# Altium project UJA1169_Test.PrjPcb
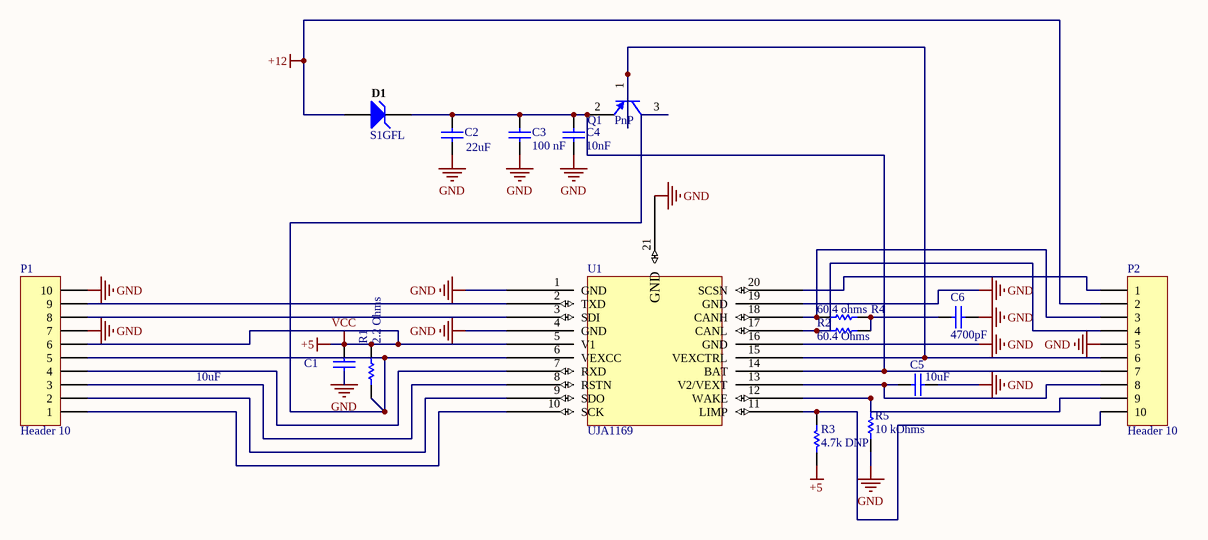
[diagram p0: UJA1169.SchDoc]
1 sheet, 16 parts. Net scope: global (net labels, ports and power ports of the same name join across sheets).
Board file: PCB.PcbDoc

## Sheet UJA1169.SchDoc
size A4; Organization: Altium Limited; Address1: L3, 12a Rodborough Rd; Address2: Frenchs Forest; Address3: NSW; Address4: Australia 2086

### Parts
C1  10uF  [CAPC1206(3216)130_L]
C2  22uF  [CAPC1210(3225)220_M]
C3  100 nF  [CAPC1005X55X10LL05]
C4  10nF  [CAPC1005X55X25NL05T05]
C5  10uF  [CAPC1206(3216)130_L]
C6  4700pF  [CAPC1005X55X25NL05T05]
D1  S1GFL  [VISH-SOD-123-2_V]
P1  Header 10  [HDR1X10]
P2  Header 10  [HDR1X10]
Q1  PnP  [ONSC-SOT-23-3-318-08_V]
R1  2.2 Ohms  [RESC1005X40X25LL10T10]
R2  60.4 Ohms  [RESC1005X40X25LL05T05]
R3  4.7k DNP  [RESC1005X40X25LL05T05]
R4  60.4 ohms  [RESC1005X40X25LL05T05]
R5  10 kOhms  [RESC1005X40X20LL05T10]
U1  UJA1169  [UJA1169_IPCcompliant]

### Nets
+5: C1.2 P1.6 R1.2 R3.2 U1.5(V1)  [also labelled VCC]
+12: D1.1(A) P2.2
GND: C1.1 C2.1 C3.2 C4.2 C5.2 C6.2 P1.7 P1.10 P2.5 R5.2 U1.1(GND) U1.4(GND) U1.16(GND) U1.19(GND) U1.21(GND)
NetC2_2: C2.2 C3.1 C4.1 D1.2(K) P2.7 Q1.2(E) U1.14(BAT)
NetC5_1: C5.1 P2.8 U1.13(V2/VEXT)
NetC6_1: C6.1 R2.2 R4.2
NetP1_1: P1.1 U1.10(SCK)
NetP1_2: P1.2 U1.9(SDO)
NetP1_3: P1.3 U1.8(RSTN)
NetP1_4: P1.4 U1.7(RXD)
NetP1_5: P1.5 Q1.3(C) R1.1 U1.6(VEXCC)
NetP1_8: P1.8 U1.3(SDI)
NetP1_9: P1.9 U1.2(TXD)
NetP2_1: P2.1 U1.20(SCSN)
NetP2_3: P2.3 R4.1 U1.18(CANH)
NetP2_4: P2.4 R2.1 U1.17(CANL)
NetP2_6: P2.6 Q1.1(B) U1.15(VEXCTRL)
NetP2_9: P2.9 R5.1 U1.12(WAKE)
NetP2_10: P2.10 R3.1 U1.11(LIMP)

### Notes on the sheet
- Title
- Size:
- Date:
- A4
- Number:
- Time:
- Revision:
- Sheet
- of
- File:

### Library data of the parts
C1 = CMP-1037-04970-1: C1206X106K8RACAUTO & JMK316BJ106KLHT - Thickness 10V -20% to +80% 1206 SMD; Case-Metric: 3216; Case-EIA: 1206; Value: 10uF; Rated Voltage: 10 V; Technology: SMT; Max Thickness: 1.3 mm; Tolerance: -20% to +80%
C2 = CMP-1038-02286-1: GCJ32ER71C226KE01L - CAP 22uF 25V -20% to +80% 1210 (3225 Metric) Thickness 2.2mm SMD; Case-Metric: 3225; Case-EIA: 1210; Rated Voltage: 25 V; Technology: SMT; Max Thickness: 2.2 mm; Value: 22uF; Tolerance: -20% to +80%
C3 = CMP-2000-05991-1: AC0402KRX7R6BB104 - Multilayer Ceramic Capacitors MLCC - SMD/SMT 100 nF 10% 10V AEC-Q200; Manufacturer: TDK; PCN Part Number: MLCCPartNumberChange30/Nov/2012; Voltage - Rated: 50V; Tolerance: ±5%; Kits: 445-9021-KIT-ND-KITMLCC100PF-10UF04026.3-50V445-9013-KIT-ND-KITMLCC0.50PF-91PF040250V; Temperature Coefficient: C0G,NP0; Capacitance: 100pF; Other Names: 445-1247-1; Product Training Modules: CSeriesGeneralApplicationsSEAT,CCV,andTVCLDesignToolsGuidetoReplacinganElectrolyticCapacitorwithanMLCC; Online Catalog: CSeries,GeneralPurpose; Datasheet URL: https://product.tdk.com/info/en/catalog/datasheets/mlcc_commercial_general_en.pdf; Lead Style: -; Mounting Technology: SurfaceMount; Features: -; Manufacturer URL: http://www.tdk.com/; Datasheet Version: 08/2016; Applications: GeneralPurpose; Lead Spacing: -; Operating Temperature: -55°C~125°C; Series: C; Standard Package: 1; Package / Case: 0402(1005Metric); Packaging: CutTape(CT); Category: Capacitors; RoHS Information: RoHSCertificate-MLCC; Mounting Type: SurfaceMount,MLCC; Height - Seated (Max): -; Family: CeramicCapacitors; Package Reference: 1005; Package Description: 2-Pin Surface Mount Device, Body 1 x 0.5 mm; Ratings: -
C4 = CMP-2008-00001-1: AC0402KRX7R8BB103 - 10000PF 25V X7R 0402; Manufacturer: Kemet; Part Number: CBR04C100J5GAC
C5 = CMP-1037-04970-1: C1206X106K8RACAUTO - Thickness 10V -20% to +80% 1206 SMD; Case-Metric: 3216; Case-EIA: 1206; Value: 10uF; Rated Voltage: 10 V; Technology: SMT; Max Thickness: 1.3 mm; Tolerance: -20% to +80%
C6 = CMP-2008-00001-1: 0402YC472K4T4A; Manufacturer: Kemet; Part Number: CBR04C100J5GAC
D1 = CMP-0931-00020-1: S1GFL - Diode; Manufacturer: Vishay Semiconductor; PartNumber: MMSZ5232B-E3-08; Power Dissipation (mW): 500; Test Current (IZT1) (mA): 20; Zener Voltage (NOM.) (V): 5.6; Zener Impedance (IZT1) (Max.) (Ohm): 11; Tolerance: +/- 5%; Packing: Tape and Reel; Int. Construction: Single; ComponentLink2URL: http://www.vishay.com/docs/85774/mmsz5225.pdf; PackageVersion: Rev. 1.9; Operating Temperature: -55 to 150 degC; ComponentLink1Description: Manufacturer URL; ComponentLink3Description: Package Specification; DatasheetVersion: Rev. 1.9; PackageReference: SOD-123-2; ComponentLink3URL: http://www.vishay.com/docs/85774/mmsz5225.pdf; PackageDescription: 2-Pin SMD, Body 2.7 x 1.55 mm, Height 1.35 mm; ComponentLink1URL: http://www.vishay.com/; RoHS: TRUE; ComponentLink2Description: Datasheet; Mounting Technology: Surface Mount
P1 P2 = Header 10: Header, 10-Pin; LatestRevisionDate: 17-Jul-2002; LatestRevisionNote: Re-released for DXP Platform.; Publisher: Altium Limited
Q1 = CMP-1048-00680-1: NSV1C200LT1G - 100 V, 3 A, Low VCE(sat), PNP Transistor, 3-Pin SOT-23, Pb-Free, Tape and Reel; Manufacturer: On Semiconductor; Note1: 0; IC Continuous (A): -2; Packing: Tape and Reel; ComponentLink3Description: Package Specification; ComponentLink2URL: http://www.onsemi.cn/pub_link/Collateral/NSS1C200L-D.PDF; Mounting Technology: Surface Mount; PackageDescription: 3-Pin Small Outline Transistor, Body 2.92 x 1.3 mm, Pitch 0.95 mm; PackageVersion: Rev. AP, 11/2009; ComponentLink3URL: http://www.onsemi.cn/pub_link/Collateral/318-08.PDF; PackageReference: SOT-23-3-318-08; DatasheetVersion: Rev. 2; RoHS: TRUE; ComponentLink1URL: http://www.onsemi.com/; Polarity: PNP; ComponentLink1Description: Manufacturer URL; PartNumber: NSV1C200LT1G; ComponentLink2Description: Datasheet
R1 = CMP-2002-04163-1: SG73P1ETTP2R20F; Manufacturer: KOA Speer; Part Number: SG73P1ETTP2R20F
R2 R4 = CMP-2002-01013-1: ERJ-2RKF60R4X; Manufacturer: Panasonic; Part Number: ERJ-2RKF60R4X
R3 = CMP-2002-00001-1: RK73H1ERTTP4701F; Part Number: CRCW0402432RFKTD; Manufacturer: Vishay Dale
R5 = CMP-2002-01347-1: RG1005P-103-D-T10; Manufacturer: Susumu; Part Number: RG1005P-103-D-T10